# EAGLE design clipper (EAGLE 9.4.0)
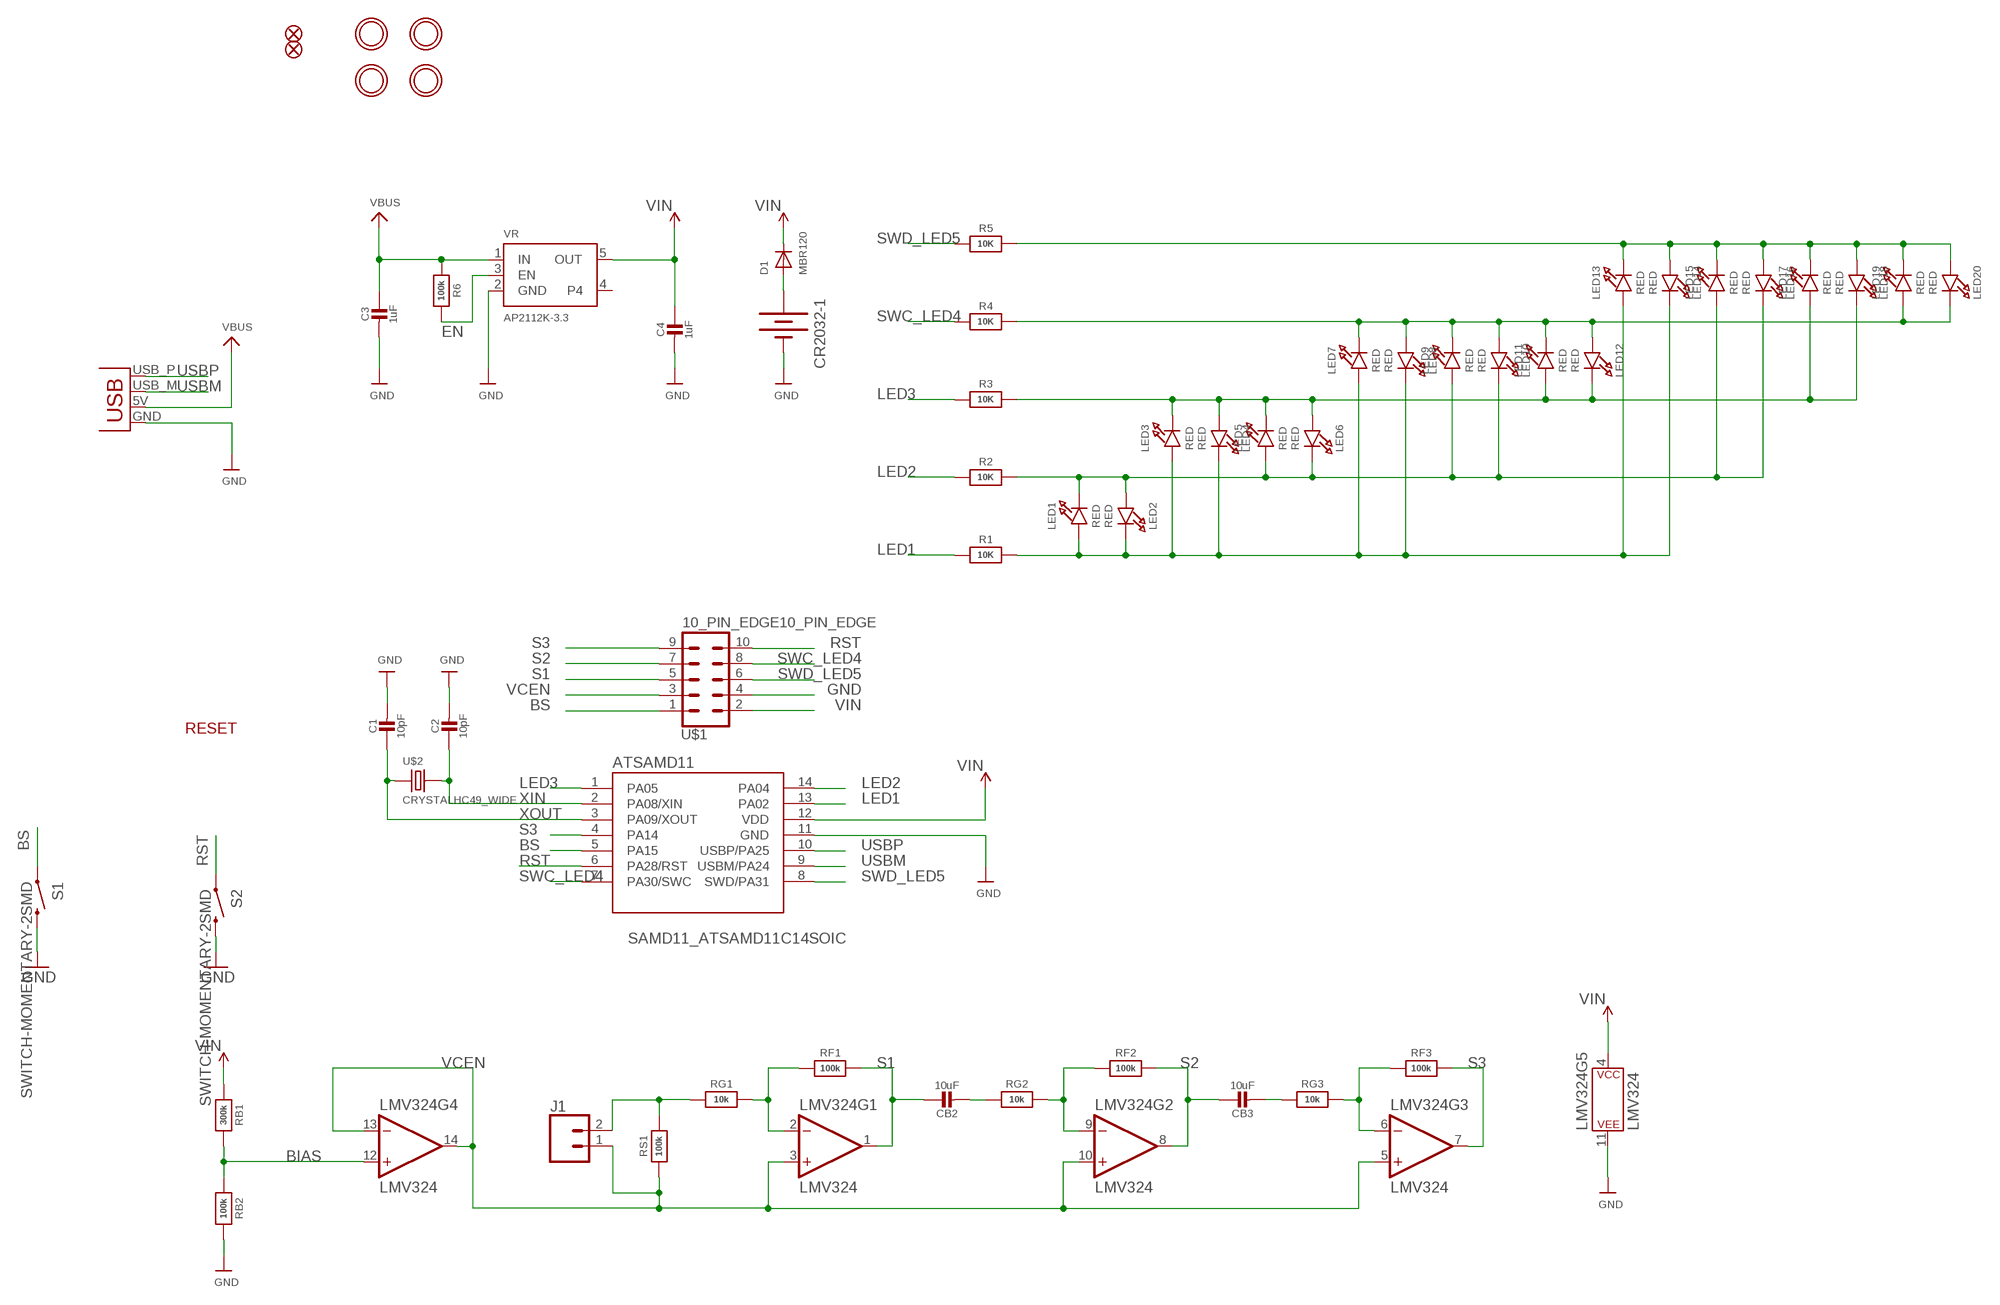
[diagram p0: schematic, sheet 1]

## Parts
ATSAMD11  SAMD11_ATSAMD11C14SOIC  [RRACE001_SO14]
C1  10pF  CAP_CERAMIC0603_NO  [0603-NO]
C2  10pF  CAP_CERAMIC0603_NO  [0603-NO]
C3  1uF  CAP_CERAMIC0603_NO  [0603-NO]
C4  1uF  CAP_CERAMIC0603_NO  [0603-NO]
CB2  10uF  CAP_CERAMIC0603_NO  [0603-NO]
CB3  10uF  CAP_CERAMIC0603_NO  [0603-NO]
CR2032-1  BATTERY_20MM_PTH  [BATTCOM_20MM_PTH]
D1  MBR120  DIODE_SOD-123FL  [SOD-123FL]
J1  CONN_02  [1X02]
LED1  RED  LED0603_NOOUTLINE  [CHIPLED_0603_NOOUTLINE]
LED2  RED  LED0603_NOOUTLINE  [CHIPLED_0603_NOOUTLINE]
LED3  RED  LED0603_NOOUTLINE  [CHIPLED_0603_NOOUTLINE]
LED4  RED  LED0603_NOOUTLINE  [CHIPLED_0603_NOOUTLINE]
LED5  RED  LED0603_NOOUTLINE  [CHIPLED_0603_NOOUTLINE]
LED6  RED  LED0603_NOOUTLINE  [CHIPLED_0603_NOOUTLINE]
LED7  RED  LED0603_NOOUTLINE  [CHIPLED_0603_NOOUTLINE]
LED8  RED  LED0603_NOOUTLINE  [CHIPLED_0603_NOOUTLINE]
LED9  RED  LED0603_NOOUTLINE  [CHIPLED_0603_NOOUTLINE]
LED10  RED  LED0603_NOOUTLINE  [CHIPLED_0603_NOOUTLINE]
LED11  RED  LED0603_NOOUTLINE  [CHIPLED_0603_NOOUTLINE]
LED12  RED  LED0603_NOOUTLINE  [CHIPLED_0603_NOOUTLINE]
LED13  RED  LED0603_NOOUTLINE  [CHIPLED_0603_NOOUTLINE]
LED14  RED  LED0603_NOOUTLINE  [CHIPLED_0603_NOOUTLINE]
LED15  RED  LED0603_NOOUTLINE  [CHIPLED_0603_NOOUTLINE]
LED16  RED  LED0603_NOOUTLINE  [CHIPLED_0603_NOOUTLINE]
LED17  RED  LED0603_NOOUTLINE  [CHIPLED_0603_NOOUTLINE]
LED18  RED  LED0603_NOOUTLINE  [CHIPLED_0603_NOOUTLINE]
LED19  RED  LED0603_NOOUTLINE  [CHIPLED_0603_NOOUTLINE]
LED20  RED  LED0603_NOOUTLINE  [CHIPLED_0603_NOOUTLINE]
LMV324  LMV324  LMV324SO14  [SO14]
MH1  MOUNTINGHOLE2.5  [MOUNTINGHOLE_2.5_PLATED]
MH2  MOUNTINGHOLE2.5  [MOUNTINGHOLE_2.5_PLATED]
MH3  MOUNTINGHOLE2.5  [MOUNTINGHOLE_2.5_PLATED]
MH4  MOUNTINGHOLE2.5  [MOUNTINGHOLE_2.5_PLATED]
R1  10K  RESISTOR_0603_NOOUT  [0603-NO]
R2  10K  RESISTOR_0603_NOOUT  [0603-NO]
R3  10K  RESISTOR_0603_NOOUT  [0603-NO]
R4  10K  RESISTOR_0603_NOOUT  [0603-NO]
R5  10K  RESISTOR_0603_NOOUT  [0603-NO]
R6  100k  RESISTOR_0603_NOOUT  [0603-NO]
RB1  300k  RESISTOR_0603_NOOUT  [0603-NO]
RB2  100k  RESISTOR_0603_NOOUT  [0603-NO]
RF1  100k  RESISTOR_0603_NOOUT  [0603-NO]
RF2  100k  RESISTOR_0603_NOOUT  [0603-NO]
RF3  100k  RESISTOR_0603_NOOUT  [0603-NO]
RG1  10k  RESISTOR_0603_NOOUT  [0603-NO]
RG2  10k  RESISTOR_0603_NOOUT  [0603-NO]
RG3  10k  RESISTOR_0603_NOOUT  [0603-NO]
RS1  100k  RESISTOR_0603_NOOUT  [0603-NO]
S1  SWITCH-MOMENTARY-2SMD  [TACTILE-SWITCH-SMD]
S2  SWITCH-MOMENTARY-2SMD  [TACTILE-SWITCH-SMD]
U$1  10_PIN_EDGE10_PIN_EDGE  [10_PIN_EDGE]
U$2  CRYSTALHC49_WIDE  [HC49U_ALL]
U$34  FIDUCIAL_1MM  [FIDUCIAL_1MM]
U$35  FIDUCIAL_1MM  [FIDUCIAL_1MM]
VR  AP2112K-3.3  VREG_SOT23-5  [SOT23-5]
X4  USBPCB  [USB-A-PCB]

## Nets
BIAS: LMV324.12(+IN) RB1.2 RB2.1
BS: ATSAMD11.5(PA15) S1.1 U$1.1
EN: R6.2 VR.3(EN)
F1: LMV324.2(-IN) RF1.1 RG1.2
F2: LMV324.9(-IN) RF2.1 RG2.2
F3: LMV324.6(-IN) RF3.1 RG3.2
GND [ss]: ATSAMD11.11(GND) C1.2 C2.2 C3.2 C4.2 CR2032-1.NEG(-) LMV324.11(P$V-) RB2.2 S1.3 S2.3 U$1.4 VR.2(GND) X4.GND
IN1: J1.2 RG1.1 RS1.2
IN2: CB2.2 RG2.1
IN3: CB3.2 RG3.1
LED1: ATSAMD11.13(PA02) R1.1
LED2: ATSAMD11.14(PA04) R2.1
LED3: ATSAMD11.1(PA05) R3.1
N$1: LED1.A LED2.C LED3.A LED4.C LED7.A LED8.C LED13.A LED14.C R1.2
N$2: LED1.C LED2.A LED5.A LED6.C LED9.A LED10.C LED15.A LED16.C R2.2
N$6: LED3.C LED4.A LED5.C LED6.A LED11.A LED12.C LED17.A LED18.C R3.2
N$9: LED13.C LED14.A LED15.C LED16.A LED17.C LED18.A LED19.C LED20.A R5.2
N$12: LED7.C LED8.A LED9.C LED10.A LED11.C LED12.A LED19.A LED20.C R4.2
N$15: CR2032-1.POS(+) D1.A
RST: ATSAMD11.6(PA28/RST) S2.1 U$1.10
S1: CB2.1 LMV324.1(OUT) RF1.2 U$1.5
S2: CB3.1 LMV324.8(OUT) RF2.2 U$1.7
S3: ATSAMD11.4(PA14) LMV324.7(OUT) RF3.2 U$1.9
SWC_LED4: ATSAMD11.7(PA30/SWC) R4.1 U$1.8
SWD_LED5: ATSAMD11.8(SWD/PA31) R5.1 U$1.6
USBM: ATSAMD11.9(USBM/PA24) X4.USB_M(D-)
USBP: ATSAMD11.10(USBP/PA25) X4.USB_P(D+)
VBUS: C3.1 R6.1 VR.1(IN) X4.5V(VBUS)
VCEN: J1.1 LMV324.3(+IN) LMV324.5(+IN) LMV324.10(+IN) LMV324.13(-IN) LMV324.14(OUT) RS1.1 U$1.3
VIN: ATSAMD11.12(VDD) C4.1 D1.C LMV324.4(P$V+) RB1.1 U$1.2 VR.5(OUT)
XIN: ATSAMD11.2(PA08/XIN) C2.1 U$2.2
XOUT: ATSAMD11.3(PA09/XOUT) C1.1 U$2.1
Unconnected: VR.4

## Notes on the sheet
- RESET

## Library data of the parts
ATSAMD11 = ST_D11:SAMD11_ATSAMD11C14: The Atmel® | SMART™ SAM D11 is a series of low-power microcontrollers using the 32-bit ARM® Cortex®-M0+ processor, and ranging from 14- to 24-pins with 16KB Flash and 4KB of SRAM
C1-C4 CB2 CB3 = microbuilder:CAP_CERAMIC: Ceramic Capacitors For new designs, use the packages preceded by an '_' character since they are more reliable: The following footprints should be used on most boards: _0402 - Standard footprint for regular board layouts _0603 - Standard footprint for regular board layouts _0805 - Standard footprint for regular board layouts _1206 - Standard footprint for regular board layouts For extremely tight-pitch boards where space is at a premium, the following 'micro-pitch' footprints can be used (smaller pads, no silkscreen outline, etc.): _0402MP - Micro-pitch footprint for very dense/compact boards _0603MP - Micro-pitch footprint for very dense/compact boards _0805MP - Micro-pitch footprint for very dense/compact boards _1206MP - Micro-pitch footprint for very dense/compact boards
CR2032-1 = RRACE001:BATTERY_20MM_PTH
D1 = adafruit:DIODE: Diode SMADIODE - SMA Surface Mount Package 20V 1A Schottky Diode Digikey: 641-1014-6-ND DO-1N4148 - Through Hole Small Current Diode SOD-123 20V 1 A (.5mV Vf) Schottky Diode - Digikey: MBRX120TPMSCT-ND SOD-323 10V 570mA (.38mV Vf, 3ns) Schottky Diode - Digikey: ZLLS410CT-ND SOD-523 30V 30mA Schottky Diode (RB751S-40TE61) - Digikey: RB751S-40TE61CT-ND SOT23-R/W - SOT23 Package (R = Solder Paste/Reflow Ovens, W = Hand-Soldering) BAT54Film 40V 300mA - Digikey: 497-7162-1-ND
J1 = SparkFun-Connectors:CONN_02: Multi connection point. Often used as Generic Header-pin footprint for 0.1 inch spaced/style header connections On any of the 0.1 inch spaced packages, you can populate with these: Break Away Headers - Straight <https://www.sparkfun.com/products/116> (PRT-00116) Break Away Male Headers - Right Angle <https://www.sparkfun.com/products/553> (PRT-00553) Female Headers <https://www.sparkfun.com/products/115> (PRT-00115) Break Away Headers - Machine Pin <https://www.sparkfun.com/products/117> (PRT-00117) Break Away Female Headers - Swiss Machine Pin <https://www.sparkfun.com/products/743> (PRT-00743) For SCREWTERMINALS and SPRING TERMINALS visit here: Screw Terimnals on SparkFun.com <https://www.sparkfun.com/search/results?term=Screw+Terminals> (5mm/3.5mm/2.54mm spacing) This device is also useful as a general connection point to wire up your design to another part of your project. Our various solder wires solder well into these plated through hole pads. Hook-Up Wire - Assortment (Stranded, 22 AWG) <https://www.sparkfun.com/products/11375> (PRT-11375) Hook-Up Wire - Assortment (Solid Core, 22 AWG) <https://www.sparkfun.com/products/11367> (PRT-11367) View the entire wire category on our website here <https://www.sparkfun.com/categories/141> Special notes: Molex polarized connector foot print use with: PRT-08233 with associated crimp pins and housings. 2.54_SCREWTERM for use with PRT-10571. 3.5mm Screw Terminal footprints for PRT-08084 5mm Screw Terminal footprints for use with PRT-08432
LED1-LED20 = microbuilder:LED: LED 0603 - 0603 Surface Mount Package 2mA: Green LED - Low Power (3.9mcd, 2ma, 1.7Vf) - Digikey: 475-2709-2-ND Orange LED - Low Power (9.8mcd, 2ma, 1.8Vf) - Digikey: 475-1194-2-ND Red LED - Low Power (5mcd, 2ma, 1.8Vf) - Digikey: 475-1195-2-ND Yellow LED - Low Power (7mcd, 2ma, 1.8Vf) - Digikey: 475-1196-2-ND 5mA: Blue LED - Low Power (17mcd, 5ma, 2.9Vf) - Digikey: LNJ937W8CRACT-ND 0805 - 0805 Surface Mount Package 2mA: Red LED (8.8mcd, 2mA, 1.8Vf, Clear) - Low Power [Digikey: 475-2510-1-ND] Green LED (5mcd, 2mA, 1.8Vf, Clear) - Low Power [Digikey: 475-2730-1-ND] Yellow LED (11.3mcd, 2mA, 1.8Vf, Clear) - Low Power [Digikey: 475-2555-1-ND] 20mA: Red LED (104mcd, 20mA, Diffused) - LS R976 [Digikey: 475-1278-6-ND] Red LED (12mcd, 20mA, 2.0Vf, Clear) - APT2012EC [Digikey: 754-1128-1-ND] Green LED (15mcd, 20mA, 2.2Vf, Clear) - APT2012GC [Digikey: 754-1131-1-ND] Orange LED (160mcd, 20mA, 2.1Vf, Clear) - APT2012SECK [Digikey: 754-1130-1-ND] 1206 - 1206 Surface Mount Package Green LED (26mcd, 20mA, Diffused) - LG N971 [Digikey: 475-1407-6-ND] Red LED (15mcd, 20mA, Diffused) - LH N974 [Digikey: 475-1416-6-ND] Cree - Cree High-Power Surface Mount LEDs XPEBWT-L1-0000-00D50 - White 111lm 350mA 2.9Vf 6200K 110° XTEAWT-00-0000-00000LEE3 - White 114lm 350mA 2.85Vf 5000K 115° Everlight - Everlight 45-21 Series Surface Mount LEDs 45-21/QK2C-B2832AC2CB2/2T - Warm White 2000mcd 20mA 3.25Vf 3050K 120° 45-21/LK2C-B38452C4CB2/2T - Nuetral White 2000mcd 20mA 3.25Vf 4150K 120° 45-21/LK2C-B50634C6CB2/2T - Cold White 2200mcd 20mA 3.25Vf 5650K 120° PLCC2 Reverse Mount LS T77K-J1L2-1-0-2-R18-Z - Red 11.25mcd 2mA 1.8Vf 630nm 120° LO T77K-L1M2-24-Z - Orange 19.6mcd 2mA 1.8Vf 606nm 120° LY T77K-K2M1-26-Z - Yellow 15.7mcd 2mA 1.8Vf 587nm 120°
LMV324 = RRACE001:LMV324: IC LMV324 Quad Op Amp Jellybean quad op-amp Datasheet <http://cdn.sparkfun.com/datasheets/Sensors/Sound/LMV324.pdf> SparkFun Products SparkFun Sensor Kit <https://www.sparkfun.com/products/13754> (DEV-13754) SparkFun Inventor's Kit for Arduino 101 <https://www.sparkfun.com/products/13844> (KIT-13844) SparkFun Sound Detector <https://www.sparkfun.com/products/12642> (SEN-12642); PROD_ID: IC-08227
MH1-MH4 = microbuilder:MOUNTINGHOLE: Mounting Hole For #2 screws (0.086"/2.18mm width, 0.094"/2.4mm hole) use 2.5mm; BOM: EXCLUDE
R1-R6 RB1 RB2 RF1-RF3 RG1-RG3 RS1 = microbuilder:RESISTOR: Resistors For new designs, use the packages preceded by an '_' character since they are more reliable: The following footprints should be used on most boards: _0402 - Standard footprint for regular board layouts _0603 - Standard footprint for regular board layouts _0805 - Standard footprint for regular board layouts _1206 - Standard footprint for regular board layouts For extremely tight-pitch boards where space is at a premium, the following 'micro-pitch' footprints can be used (smaller pads, no silkscreen outline, etc.): _0402MP - Micro-pitch footprint for very dense/compact boards _0603MP - Micro-pitch footprint for very dense/compact boards _0805MP - Micro-pitch footprint for very dense/compact boards _1206MP - Micro-pitch footprint for very dense/compact boards
S1 S2 = SparkFun-Electromechanical:SWITCH-MOMENTARY-2: Various NO switches- pushbuttons, reed, etc; PROD_ID: SWCH-08247
U$1 = eclibrary:10_PIN_EDGE
U$2 = RRACE001:CRYSTAL
U$34 U$35 = microbuilder:FIDUCIAL: Fiducial Alignment Points Various fiducial points for machine vision alignment.; BOM: EXCLUDE
VR = microbuilder:VREG_SOT23-5: SOT23-5 Fixed Voltage Regulators Part Current Out V Out V In V Dropout θJA (°C/W) TJ (°C) Digikey Part No. ADP121 150mA 3.3V 3.4-5.5V 0.09V @ 150mA -- -- ADP121-AUJZ33R7CT-ND ADP121 150mA 3.0V 3.1-5.5V 0.09V @ 150mA -- -- ADP121-AUJZ30R7CT-ND ADP122 300mA 3.3V 3.4-5.5V 0.085V @ 300mA -- -- ADP122AUJZ-3.3-R7CT-ND ADP1712 300mA 3.3V 3.5-5.5V 0.17V @ 300mA -- -- ADP1712AUJZ-3.3-R7TR-ND AP7311 (Low Cost) 150mA 3.3V 3.5-6V 0.15V @ 150mA -- -- AP7311-33WG-7DICT-ND LD39015M18R 150mA 1.8V 1.9V-5.5V 0.08V @ 100mA -- -- 497-6977-1-ND LP2985A-33DBVR 150mA 3.3V 3.3-16V 0.28V @ 150mA 206 150 296-18479-1-ND MCP1824T-3302E/OT 300mA 3.3V 3.5V-6V 0.2V @ 300mA -- -- MCP1824T-3302E/OTCT-ND MIC5205-2.5YM5 TR 150mA 2.5V 2.7-16V 0.165V @ 150mA -- -- 576-1257-2-ND MIC5205-3.0YM5 TR 150mA 3.0V 3.2V-16V 0.165V @ 150mA -- -- 576-1258-2-ND MIC5205-3.3YM5 TR 150mA 3.3V 3.5V-16V 0.165V @ 150mA -- -- 576-1259-2-ND TPS780330220 150mA 3.3V+2.2V 3.6-5.5V 250mV Max -- -- 296-23332-1-ND TDA3663/N1,135 100mA 3.3V 3.5-45V 0.18V @ 50mA -- -- 568-5343-1-ND Max operating temp can be calculated using θJA, TJ (max junction temperature), and power in watts. Set the "Maximum Ambient Temperature" until it reaches TJ ("Max Junction Temperature"), which is the absolute limit for safe use of the regulator: Heat Sink Temperature Calculator <http://www.daycounter.com/Calculators/Heat-Sink-Temperature-Calculator.phtml> For example, With 12V source into a 3.3V LP2985 and a 30mA load, we are dissipating (12V-3.3V) * 0.03A = 0.261W. With a θJA of 206 °C/W, a TJ of 150°C, and 261mW we can safely use the chip without a heat sink up to 75°C (=147.1°C Junction Temperature).
X4 = SparkFun:USB: USB Connectors USB-B-PTH is fully proven SKU : PRT-00139 USB-miniB is fully proven SKU : PRT-00587 USB-A-PCB is untested. USB-A-H is throughly reviewed, but untested. Spark Fun Electronics SKU : PRT-00437 USB-B-SMT is throughly reviewed, but untested. Needs silkscreen touching up. USB-A-S has not been used/tested USB-MB-H has not been used/tested

## Net classes
0 default: width 0.152 mm, drill 0.254 mm, clearance 0.152 mm
1 ss: width 0.203 mm, drill 0.356 mm, clearance 0.254 mm
2 pwr: width 0.203 mm, drill 0.356 mm, clearance 0.254 mm

## Board
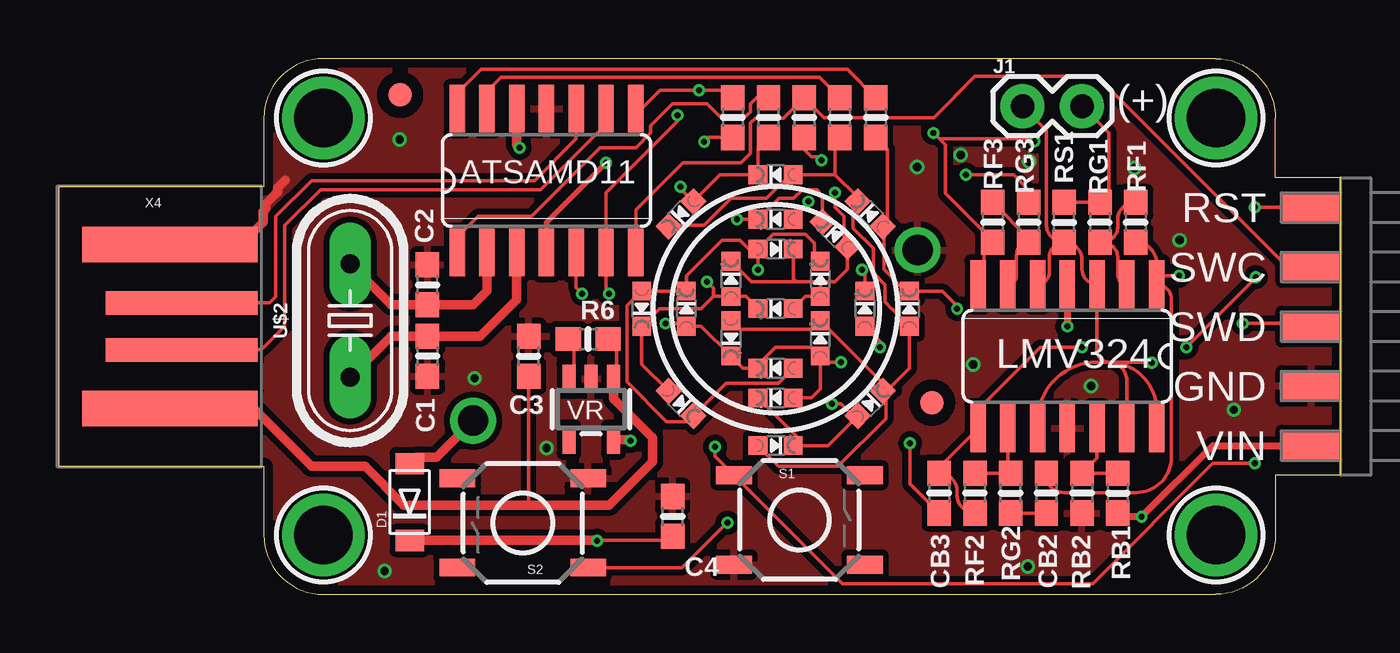
[diagram p1: board, top side]
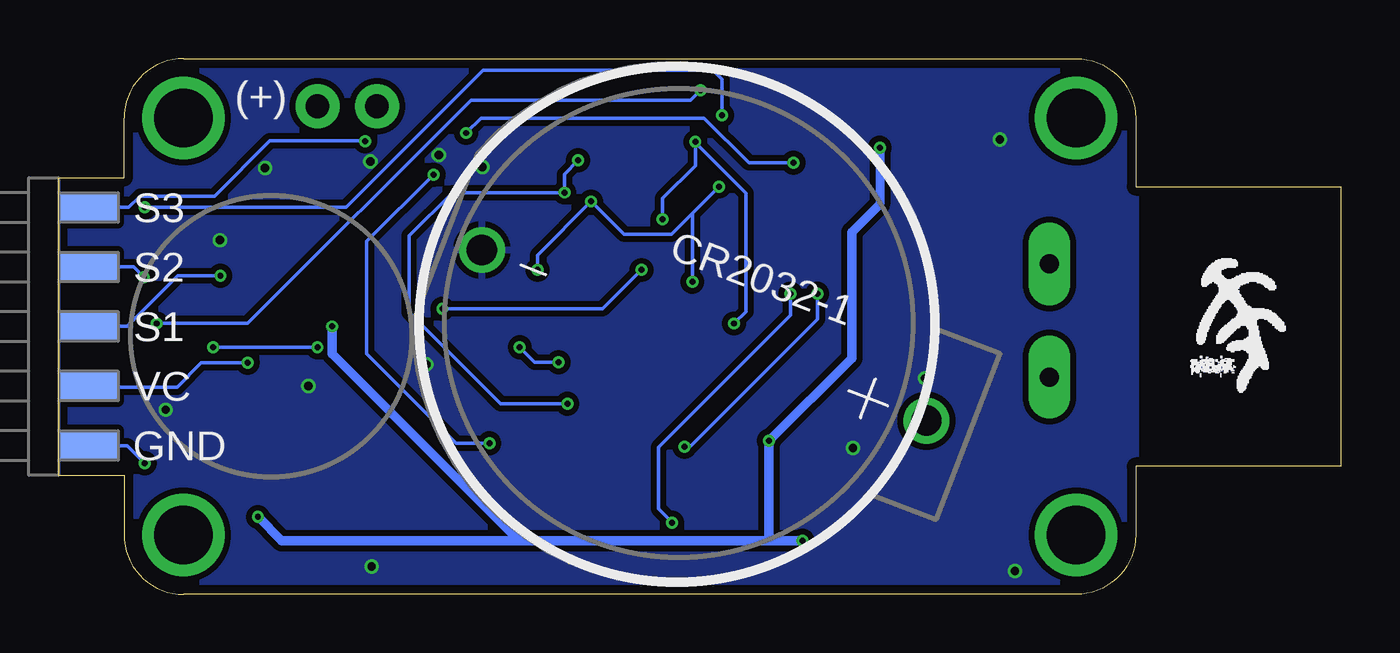
[diagram p2: board, bottom side, seen from below]

Size 54.74 x 22.86 mm. Coordinates in mm from the lower left corner, seen from the top.
Outline: 11.3,0 49.4,0 arc90 51.94,2.54 51.94,5.08 54.74,5.08 54.74,17.78 51.94,17.78 51.94,20.32 arc90 49.4,22.86 11.3,22.86 arc90 8.76,20.32 8.76,17.4 0,17.4 0,5.46 8.76,5.46 8.76,2.54 arc90 11.3,0
Copper layers (1*16): Top 0.035559375mm / dielectric 1.6mm / Bottom 0.035559375mm
Design rules "oshpark-2layer 2019-July": minimum track width 6mil, minimum drill 10mil, track to track 6mil, track to pad 6mil, pad to pad 6mil, via to via 6mil, smd to smd 6mil, copper to edge 15mil, drill to drill 6mil, minimum pad ring 5mil, minimum via ring 5mil, stop-mask expansion 2.5mil, vias tented up to drill 0mil, thermal gap 10mil

### Footprints (pad centres in the part's own frame; a part is rotated, then mirrored left to right if it is on the bottom)
RRACE001_SO14 = smd 0.66 x 2.032: 1 -3.81,-3.073; 2 -2.54,-3.073; 3 -1.27,-3.073; 4 0,-3.073; 5 1.27,-3.073; 6 2.54,-3.073; 7 3.81,-3.073; 8 3.81,3.073; 9 2.54,3.073; 10 1.27,3.073; 11 0,3.073; 12 -1.27,3.073; 13 -2.54,3.073; 14 -3.81,3.073
0603-NO = smd 1.075 x 1: 1 -0.85,0; 2 0.85,0
BATTCOM_20MM_PTH = drill 1.3: NEG -10.16,0; POS 10.16,0
SOD-123FL = smd 0.91 x 1.22: A 1.637,0; C -1.637,0
1X02 = drill 1.016 pad 1.88: 1 0,0; 2 2.54,0
CHIPLED_0603_NOOUTLINE = smd 0.8 x 0.8: A 0,-0.75; C 0,0.75
SO14 = smd 0.66 x 2.032: 1 -3.81,-3.073; 2 -2.54,-3.073; 3 -1.27,-3.073; 4 0,-3.073; 5 1.27,-3.073; 6 2.54,-3.073; 7 3.81,-3.073; 8 3.81,3.073; 9 2.54,3.073; 10 1.27,3.073; 11 0,3.073; 12 -1.27,3.073; 13 -2.54,3.073; 14 -3.81,3.073
MOUNTINGHOLE_2.5_PLATED = drill 2.5 pad 3.2: P$1 0,0
TACTILE-SWITCH-SMD = smd 1.524 x 0.762: 1 -2.794,1.905; 2 2.794,1.905; 3 -2.794,-1.905; 4 2.794,-1.905
10_PIN_EDGE = smd 1.27 x 2.54: 1 5.08,0; 3 2.54,0; 5 0,0; 7 -2.54,0; 9 -5.08,0 | smd 1.27 x 2.54 bottom: 2 5.08,0; 4 2.54,0; 6 0,0; 8 -2.54,0; 10 -5.08,0
HC49U_ALL = drill 0.813 pad 1.778 long: 1 -2.413,0; 2 2.413,0
FIDUCIAL_1MM = smd 1 x 1: 1 0,0
SOT23-5 = smd 0.55 x 1.2: 1 -0.95,-1.3; 2 0,-1.3; 3 0.95,-1.3; 4 0.95,1.3; 5 -0.95,1.3
USB-A-PCB = smd 7.5 x 1.5: 5V -0.2,-3.5; GND -0.2,3.5 | smd 6.5 x 1: USB_M 0.3,-1; USB_P 0.3,1

### Placement (x,y rotation side)
ATSAMD11  20.83,17.65 0 top
C1  15.75,10.16 270 top
C2  15.75,13.21 90 top
C3  20.07,10.16 90 top
C4  26.21,3.33 90 top
CB2  42.16,4.32 270 top
CB3  37.59,4.32 270 top
CR2032-1  27.18,11.05 339 bottom
D1  14.99,3.94 90 top
J1  41.15,20.83 0 top
LED1  36.32,12.19 0 top
LED2  34.65,16.23 45 top
LED3  30.61,17.91 90 top
LED4  26.57,16.23 135 top
LED5  24.89,12.19 180 top
LED6  26.57,8.15 225 top
LED7  30.61,6.35 270 top
LED8  34.65,8.15 315 top
LED9  30.61,14.73 270 top
LED10  32.51,13.46 0 top
LED11  28.7,13.46 0 top
LED12  30.61,12.19 90 top
LED13  28.7,10.92 180 top
LED14  32.51,10.92 0 top
LED15  30.61,9.65 90 top
LED16  26.8,12.19 0 top
LED17  30.61,16 90 top
LED18  34.42,12.19 0 top
LED19  33.15,15.37 45 top
LED20  30.61,8.38 90 top
LMV324  43.05,10.16 180 top
MH1  11.3,2.54 0 top
MH2  49.4,2.54 0 top
MH3  11.3,20.32 0 top
MH4  49.4,20.32 0 top
R1  33.35,20.35 270 top
R2  34.87,20.35 270 top
R3  30.3,20.35 270 top
R4  31.83,20.35 270 top
R5  28.78,20.35 270 top
R6  22.61,10.9 180 top
RB1  45.21,4.32 90 top
RB2  43.69,4.32 270 top
RF1  45.97,15.88 270 top
RF2  39.12,4.32 270 top
RF3  39.88,15.88 270 top
RG1  44.45,15.88 270 top
RG2  40.64,4.32 90 top
RG3  41.4,15.88 270 top
RS1  42.93,15.88 90 top
S1  31.62,3.17 0 top
S2  19.81,3.05 180 top
U$1  53.47,11.43 270 bottom
U$2  12.45,11.68 90 top
U$34  14.58,21.31 180 top
U$35  37.29,8.18 0 top
VR  22.73,7.9 180 top
X4  4.95,11.43 0 top

### Tracks (layer width: path | path; a pad name or v marks a point on that pad's centre or on a via)
BIAS
  Top 0.152: RB1.2 RB2.1 44.32,5.8 LMV324.12
BS  (via drill 0.25 pad 0.51)
  Top 0.152: v22.35,12.83 22.1,13.08 ATSAMD11.5 | v28.02,6.3 28.02,5.89 S1.1 33.45,0.46 44.15,0.46 49.28,5.59 v51.05,5.59
  Bottom 0.152: v28.02,6.3 27.79,6.3 22.35,11.73 v22.35,12.83 | v51.05,5.59 51.82,6.35 U$1.1
EN
  Top 0.152: R6.2 22.01,10.64 22.01,9.43 VR.3
F1
  Top 0.152: RG1.2 44.54,15.03 | 44.54,15.03 arc-90 45.21,14.35 45.21,13.61 arc90 LMV324.2 | RF1.1 45.94,16.73 arc90 45.21,16 45.21,15.7 arc-90 44.54,15.03
F2
  Top 0.152: RF2.1 40.51,5.17 | 40.51,5.17 RG2.2 | LMV324.9 40.51,5.17
F3
  Top 0.152: LMV324.6 arc90 40.89,13.61 40.89,14.52 arc-90 RG3.2 41.4,15.2 RF3.1
GND  (via drill 0.36 pad 0.51)
  Top 0.203: ATSAMD11.11 arc90 20.57,20.47
  Top 0.406: 9.68,17.68 9.35,17.35 9.35,17.16 8.84,16.65 8.84,16.45 8.74,16.35 8.74,15.88 7.79,14.93 X4.GND
  other vias: 44.07,8.89 39.04,9.8 50.16,7.87 41.38,1.19 13.92,0.99 14.55,19.41 47.85,15.11 36.65,18.24 38.51,18.75 41.43,18.47 45.92,18.19 20.83,6.25 17.75,9.22
  pour Top: 10.67,22.86 50.04,22.86 51.94,20.95 51.94,17.78 54.74,17.78 54.74,5.08 51.94,5.08 51.94,1.91 50.04,0 10.67,0 8.76,1.91 8.76,20.95
  pour Bottom: 10.67,22.86 50.04,22.86 51.94,20.95 51.94,17.78 54.74,17.78 54.74,5.08 51.94,5.08 51.94,1.91 50.04,0 10.67,0 8.76,1.91 8.76,20.95
IN1
  Top 0.152: RS1.2 RG1.1 arc90 44.83,17.11 44.83,19.68 J1.2
IN2
  Top 0.152: RG2.1 CB2.2
IN3  (via drill 0.25 pad 0.51)
  Top 0.152: v36.35,6.45 36.35,4.71 CB3.2 | RG3.1 41.4,17.27 40.77,17.91 v38.73,17.91
  Bottom 0.152: v38.73,17.91 41.58,15.06 41.58,10.26 37.77,6.45 v36.35,6.45
LED1
  Top 0.152: R1.1 32.47,22.07 18.9,22.07 18.29,21.46 ATSAMD11.13
LED2
  Top 0.152: ATSAMD11.14 17.02,21.39 18.03,22.4 33.67,22.4 R2.1
LED3
  Top 0.152: R3.1 29.79,21.2 29.54,20.94 29.54,20.6 29.37,20.43 28.18,20.43 27.68,20.93 26.22,20.93 25.27,19.99 25.27,19.68 24.64,19.05 23.11,19.05 20.19,16.13 17.91,16.13 17.02,15.24 ATSAMD11.1
N$1
  Top 0.152: 33.15,17.91 LED3.A 31.24,17.91 30.23,16.89 28.7,16.89 27.56,15.75 26.08,15.75 LED4.C | 33.15,17.91 34.12,16.94 LED2.C | LED2.C | 35.31,8.68 35.35,8.68 36.32,9.65 LED1.A 35.57,12.19 35.56,12.19 35.28,12.48 35.28,13.21 34.77,13.72 34.77,14.76 33.91,15.62 33.91,16.55 LED2.C | 35.31,8.68 LED8.C | LED8.C | LED13.A 28.71,11.67 29.08,11.3 32.14,11.3 LED14.C 35.18,9.01 LED8.C | LED7.A 29.86,6.33 30.72,5.46 33.27,5.46 35.31,7.49 35.31,8.68 | R1.2 33.15,19.29 33.15,17.91
N$2  (via drill 0.25 pad 0.51)
  Top 0.152: LED2.A 35.22,15.66 | 35.22,15.66 35.31,15.57 35.23,15.49 35.23,13.87 36.16,12.94 LED1.C 37.73,12.94 38.35,12.32 v38.35,12.19 | LED10.C 32.26,14.47 32.26,14.99 31.88,15.37 30.49,15.37 LED9.A | LED15.A 30.72,9.02 28.49,9.02 LED6.C 26.84,7.37 25.96,7.37 24.26,9.07 24.26,12.31 LED5.A LED16.C 26.8,13.59 28.32,15.11 29.08,15.11 29.46,14.73 LED9.A | R2.2 35.38,18.99 35.38,15.66 35.22,15.66 | LED9.A v29.86,13.84
  Bottom 0.152: v29.86,13.84 31.51,12.19 v38.35,12.19
N$6  (via drill 0.25 pad 0.51)
  Top 0.152: LED6.A 24.89,9.82 LED5.C 25.64,12.19 27.43,12.19 27.95,12.71 | LED12.C 29.34,12.71 LED11.A 27.95,12.71 | R3.2 29.86,19.05 LED3.C 28.24,17.91 LED4.A 26.54,17.32 v26.54,17.4 | v32,16.76 31.36,16.12 LED17.A | LED18.C 34.42,13.84 v34.29,13.84 | v27.69,13.34 27.95,13.07 27.95,12.71
  Bottom 0.152: v34.29,13.84 34.29,14.48 v32,16.76 30.61,15.37 28.57,15.37 v26.54,17.4 27.69,16.26 v27.69,13.34
N$9  (via drill 0.25 pad 0.51)
  Top 0.152: LED14.A 32.14,10.54 30.61,10.54 29.86,9.79 LED15.C 29.22,9.65 LED13.C 27.43,11.44 LED16.A 26.68,11.56 v25.91,11.56 | LED20.A 32.13,8.38 32.51,8.76 LED14.A | R5.2 27.75,19.5 v27.56,19.3 | v28.96,16 LED17.C 30.75,16.89 31.37,16.89 31.75,17.27 32.36,17.27 32.62,17.02 LED19.C | LED18.A 35.05,10.81 v35.05,10.54 | v33.4,9.91 32.78,9.91 LED14.A
  Bottom 0.152: v28.96,16 28.96,16.89 27.56,18.29 v27.56,19.3 27.56,19.28 25.4,17.12 25.4,12.06 v25.91,11.56 | v35.05,10.54 34.42,9.91 v33.4,9.91
N$12  (via drill 0.25 pad 0.51)
  Top 0.152: LED8.A 34.01,7.52 | 34.01,7.52 32.85,6.35 LED7.C 31.5,6.35 31.5,6.74 LED20.C | LED12.A 31.88,12.71 LED10.A 32.51,13.21 32.39,13.34 | LED11.C 29.58,13.34 31.5,13.34 | LED9.C 31.37,14.72 31.37,13.46 31.5,13.34 | 31.5,13.34 32.39,13.34 | 32.39,13.34 33.15,13.34 33.68,13.87 LED19.A 33.53,14.99 33.53,16.13 33.15,16.51 v33.15,17.14 | R4.2 31.75,19.42 31.75,19.05 32.13,18.67 32.41,18.67 v32.56,18.52 | v33.02,8.13 33.4,8.13 34.01,7.52
  Bottom 0.152: v32.56,18.52 33.15,17.93 v33.15,17.14 37.92,17.14 39.78,15.29 39.78,12.04 35.87,8.13 v33.02,8.13
N$15
  Top 0.406: D1.A 15.25,5.84 16.13,5.84 CR2032-1.POS
RST  (via drill 0.25 pad 0.51)
  Top 0.152: v23.49,12.83 23.37,12.95 ATSAMD11.6 23.37,17.14 26.42,20.19 v26.42,20.45 | v51.05,16.51 U$1.10 | S2.1 26.62,1.14 28.52,3.05 v28.55,3.05
  Bottom 0.152: v23.49,12.83 23.49,11.91 29.13,6.27 29.13,3.66 28.54,3.06 v28.55,3.05 | v26.42,20.45 26.42,21.97 26.8,22.35 36.63,22.35 42.47,16.51 v51.05,16.51
S1  (via drill 0.25 pad 0.51)
  Top 0.152: CB2.1 42.16,5.08 arc90 42.9,4.34 46,4.34 arc90 47.5,5.84 47.5,12.6 arc90 LMV324.1 | RF1.2 arc-90 46.86,14.14 LMV324.1 | LMV324.1 47.22,13.59 v47.83,13.59
  Bottom 0.152: v47.83,13.59 49.66,13.59 51.82,11.43 U$1.5
S2  (via drill 0.25 pad 0.51)
  Top 0.152: RF2.2 arc-90 38.35,4.23 38.35,4.41 arc90 CB3.1 arc90 37.59,5.42 39.24,7.07 LMV324.8 39.24,7.87 41.91,10.54 v43.69,10.54 | v48.13,10.54 51.11,13.51 v51.11,13.54
  Bottom 0.152: v43.69,10.54 v48.13,10.54 | v51.11,13.54 51.54,13.97 U$1.7
S3  (via drill 0.25 pad 0.51)
  Top 0.152: LMV324.7 arc90 39.5,13.49 39.5,14.64 arc-90 RF3.2 39.88,15.09 37.85,17.12 37.85,19.18 v37.34,19.68 37.59,19.43 41.55,19.43 v41.66,19.33
  Top 0.203: v23.37,18.41 20.83,15.88 ATSAMD11.4
  Bottom 0.152: v37.34,19.68 36.7,20.32 27.18,20.32 25.27,18.41 v23.37,18.41 | v41.66,19.33 41.68,19.36 45.72,19.36 48.08,16.99 51.25,16.99 51.74,16.51 U$1.9
SWC_LED4
  Top 0.152: U$1.8 52.45,13.97 44.32,22.1 39.12,22.1 37.36,20.34 32.68,20.34 R4.1 30.95,20.32 29.74,20.32 29.54,20.12 29.54,18.82 29.13,18.41 26.64,18.41 24.64,16.41 ATSAMD11.7
SWD_LED5  (via drill 0.25 pad 0.51)
  Top 0.152: ATSAMD11.8 24.89,20.73 25.68,21.52 v27.33,21.52 28.46,21.52 R5.1 | v50.55,11.56 53.34,11.56 U$1.6
  Bottom 0.152: v27.33,21.52 27.77,21.08 37.14,21.08 46.66,11.56 v50.55,11.56
USBM
  Top 0.152: X4.USB_M 8.65,10.43 9.65,11.43 9.65,15.75 11.18,17.27 20.57,17.27 23.37,20.07 ATSAMD11.9
USBP
  Top 0.152: ATSAMD11.10 22.1,19.43 20.32,17.65 10.79,17.65 9.27,16.13 9.27,12.7 9.02,12.45 5.27,12.45 X4.USB_P
VBUS
  Top 0.152: R6.1 23.81,10.54 23.81,9.33 VR.1 | C3.1 20.07,3.81
  Top 0.406: X4.5V 8.33,7.93 10.79,5.46 13.08,5.46 14.73,3.81 20.07,3.81 23.49,3.81 25.35,5.66 25.35,6.68 23.68,8.35 VR.1
VCEN  (via drill 0.25 pad 0.51)
  Top 0.152: 44.83,9.91 arc-90 44.32,10.41 LMV324.3 arc-90 43.69,13.87 43.69,14.26 arc90 RS1.1 | 44.83,9.91 arc-90 45.59,9.14 LMV324.13 | 46.86,7.87 arc90 44.83,9.91 | RS1.1 arc90 42.29,14.39 42.29,13.74 arc-90 LMV324.5 | LMV324.10 41.78,7.37 arc-90 44.32,9.91 44.83,9.91 | RS1.1 arc-90 42.16,15.79 42.16,19.81 J1.1 | 44.83,9.91 46.63,9.91 v46.66,9.88
  Top 0.203: LMV324.14 46.86,7.87
  Bottom 0.152: v46.66,9.88 48.64,9.88 49.68,8.84 53.42,8.84 U$1.3
VIN  (via drill 0.25 pad 0.51)
  Top 0.152: C4.1 26.04,2.3 22.85,2.3
  Top 0.305: LMV324.4 v43.05,11.43 | RB1.1 45.38,3.3 v46.23,3.3 49.28,6.35 U$1.2
  Top 0.406: ATSAMD11.12 19.56,19.18 v19.68,19.05 | v22.99,2.29 22.86,2.29 22.85,2.3 D1.C | VR.5 24.36,6.6 v24.41,6.55
  Bottom 0.381: v19.68,19.05 19.68,16.64 20.88,15.44
  Bottom 0.406: v46.23,3.3 45.21,2.29 35.08,2.29 | v22.99,2.29 24.41,2.29 | 24.41,2.29 v24.41,6.55 20.88,10.08 20.88,15.44 | v43.05,11.43 43.05,10.26 35.08,2.29 | 35.08,2.29 24.41,2.29
XIN
  Top 0.406: U$2.2 14.19,12.36 C2.1 17.69,12.36 18.29,12.95 ATSAMD11.2
XOUT
  Top 0.406: U$2.1 14.19,11.01 C1.1 17.99,11.01 19.56,12.57 ATSAMD11.3

### Text on the board
tNames: (+) | RST | SWC | SWD | GND | VIN
bNames: (+) | S3 | S2 | S1 | VC | GND